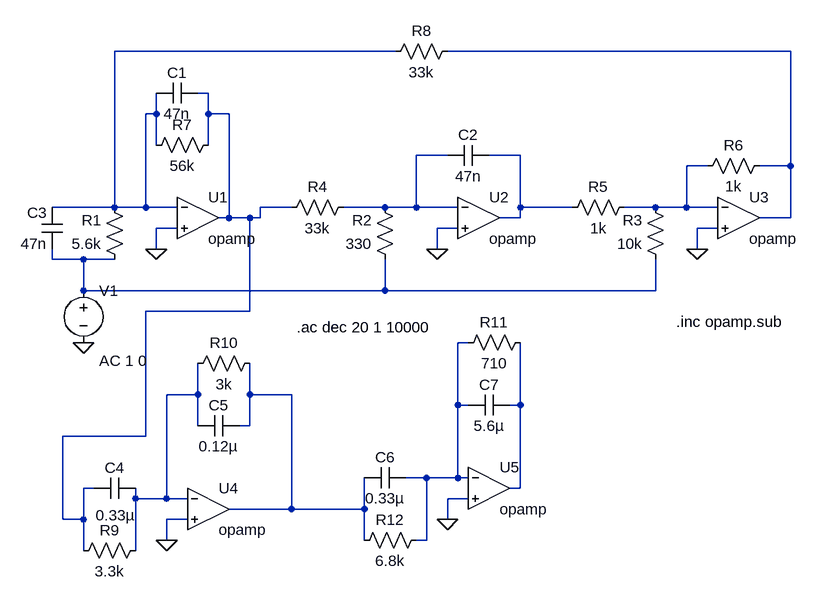
[diagram p0: schematic 344_circuit.asc]
344_circuit.asc, the LTspice schematic file:
Version 4
SHEET 1 968 1024
WIRE 352 -128 -80 -128
WIRE 960 -128 432 -128
WIRE 64 -64 48 -64
WIRE -16 -32 -16 -64
WIRE -16 -32 -32 -32
WIRE 64 -32 64 -64
WIRE 96 -32 64 -32
WIRE -16 16 -16 -32
WIRE 64 16 64 -32
WIRE 432 32 384 32
WIRE 544 32 496 32
WIRE 832 48 800 48
WIRE 960 48 960 -128
WIRE 960 48 912 48
WIRE -80 112 -80 -128
WIRE -80 112 -176 112
WIRE -32 112 -32 -32
WIRE -32 112 -80 112
WIRE 16 112 -32 112
WIRE 192 112 144 112
WIRE 336 112 272 112
WIRE 384 112 384 32
WIRE 384 112 336 112
WIRE 448 112 384 112
WIRE 544 112 544 32
WIRE 624 112 544 112
WIRE 752 112 704 112
WIRE 800 112 800 48
WIRE 800 112 752 112
WIRE 848 112 800 112
WIRE 96 128 96 -32
WIRE 96 128 80 128
WIRE 128 128 96 128
WIRE 144 128 144 112
WIRE 144 128 128 128
WIRE 544 128 544 112
WIRE 544 128 512 128
WIRE 960 128 960 48
WIRE 960 128 912 128
WIRE 16 144 -16 144
WIRE 448 144 416 144
WIRE 848 144 816 144
WIRE -16 176 -16 144
WIRE 416 176 416 144
WIRE 816 176 816 144
WIRE -176 192 -176 176
WIRE -128 192 -176 192
WIRE -80 192 -128 192
WIRE -128 240 -128 192
WIRE 336 240 336 192
WIRE 336 240 -128 240
WIRE 752 240 752 192
WIRE 752 240 336 240
WIRE 128 272 128 128
WIRE 128 272 -32 272
WIRE 464 320 448 320
WIRE 48 400 48 352
WIRE 48 400 0 400
WIRE 128 400 128 352
WIRE 192 400 128 400
WIRE 448 416 448 320
WIRE 464 416 448 416
WIRE 544 416 544 320
WIRE 544 416 528 416
WIRE 48 448 48 400
WIRE 128 448 128 400
WIRE 128 448 112 448
WIRE -32 464 -32 272
WIRE -32 464 -160 464
WIRE 400 528 368 528
WIRE 448 528 448 416
WIRE 448 528 400 528
WIRE 464 528 448 528
WIRE -112 544 -128 544
WIRE 544 544 544 416
WIRE 544 544 528 544
WIRE -48 560 -48 544
WIRE 0 560 0 400
WIRE 0 560 -48 560
WIRE 32 560 0 560
WIRE 464 560 432 560
WIRE 192 576 192 400
WIRE 192 576 96 576
WIRE 304 576 304 528
WIRE 304 576 192 576
WIRE -160 592 -160 464
WIRE -128 592 -128 544
WIRE -128 592 -160 592
WIRE 32 592 0 592
WIRE 432 592 432 560
WIRE 0 624 0 592
WIRE 304 624 304 576
WIRE 400 624 400 528
WIRE 400 624 384 624
WIRE -128 640 -128 592
WIRE -48 640 -48 560
FLAG -16 176 0
FLAG 416 176 0
FLAG 816 176 0
FLAG -128 320 0
FLAG 432 592 0
FLAG 0 624 0
SYMBOL res -64 208 R180
WINDOW 0 36 76 Left 2
WINDOW 3 36 40 Left 2
SYMATTR InstName R1
SYMATTR Value 5.6k
SYMBOL res 352 208 R180
WINDOW 0 36 76 Left 2
WINDOW 3 36 40 Left 2
SYMATTR InstName R2
SYMATTR Value 330
SYMBOL res 768 208 R180
WINDOW 0 36 76 Left 2
WINDOW 3 36 40 Left 2
SYMATTR InstName R3
SYMATTR Value 10k
SYMBOL res 176 128 R270
WINDOW 0 32 56 VTop 2
WINDOW 3 0 56 VBottom 2
SYMATTR InstName R4
SYMATTR Value 33k
SYMBOL res 608 128 R270
WINDOW 0 32 56 VTop 2
WINDOW 3 0 56 VBottom 2
SYMATTR InstName R5
SYMATTR Value 1k
SYMBOL res 816 64 R270
WINDOW 0 32 56 VTop 2
WINDOW 3 0 56 VBottom 2
SYMATTR InstName R6
SYMATTR Value 1k
SYMBOL res -32 32 R270
WINDOW 0 32 56 VTop 2
WINDOW 3 0 56 VBottom 2
SYMATTR InstName R7
SYMATTR Value 56k
SYMBOL res 336 -112 R270
WINDOW 0 32 56 VTop 2
WINDOW 3 0 56 VBottom 2
SYMATTR InstName R8
SYMATTR Value 33k
SYMBOL cap 48 -80 R90
WINDOW 0 0 32 VBottom 2
WINDOW 3 32 32 VTop 2
SYMATTR InstName C1
SYMATTR Value 47n
SYMBOL cap 496 16 R90
WINDOW 0 0 32 VBottom 2
WINDOW 3 32 32 VTop 2
SYMATTR InstName C2
SYMATTR Value 47n
SYMBOL cap -160 176 R180
WINDOW 0 24 56 Left 2
WINDOW 3 24 8 Left 2
SYMATTR InstName C3
SYMATTR Value 47n
SYMBOL OpAmps\\opamp 48 64 R0
SYMATTR InstName U1
SYMBOL OpAmps\\opamp 480 64 R0
SYMATTR InstName U2
SYMBOL OpAmps\\opamp 880 64 R0
SYMATTR InstName U3
SYMBOL voltage -128 224 R0
WINDOW 123 24 124 Left 2
WINDOW 39 0 0 Left 0
SYMATTR Value2 AC 1 0
SYMATTR InstName V1
SYMATTR Value ""
SYMBOL cap -48 528 R90
WINDOW 0 0 32 VBottom 2
WINDOW 3 42 31 VTop 2
SYMATTR InstName C4
SYMATTR Value 0.33µ
SYMBOL cap 112 432 R90
WINDOW 0 0 32 VBottom 2
WINDOW 3 32 32 VTop 2
SYMATTR InstName C5
SYMATTR Value 0.12µ
SYMBOL cap 368 512 R90
WINDOW 0 0 32 VBottom 2
WINDOW 3 32 32 VTop 2
SYMATTR InstName C6
SYMATTR Value 0.33µ
SYMBOL cap 528 400 R90
WINDOW 0 0 32 VBottom 2
WINDOW 3 32 32 VTop 2
SYMATTR InstName C7
SYMATTR Value 5.6µ
SYMBOL res -32 624 R90
WINDOW 0 0 56 VBottom 2
WINDOW 3 32 56 VTop 2
SYMATTR InstName R9
SYMATTR Value 3.3k
SYMBOL res 144 336 R90
WINDOW 0 0 56 VBottom 2
WINDOW 3 32 56 VTop 2
SYMATTR InstName R10
SYMATTR Value 3k
SYMBOL res 560 304 R90
WINDOW 0 0 56 VBottom 2
WINDOW 3 32 56 VTop 2
SYMATTR InstName R11
SYMATTR Value 710
SYMBOL res 400 608 R90
WINDOW 0 0 56 VBottom 2
WINDOW 3 32 56 VTop 2
SYMATTR InstName R12
SYMATTR Value 6.8k
SYMBOL OpAmps\\opamp 64 512 R0
SYMATTR InstName U4
SYMBOL OpAmps\\opamp 496 480 R0
SYMATTR InstName U5
TEXT 200 296 Left 2 !.ac dec 20 1 10000
TEXT 784 288 Left 2 !.inc opamp.sub

The netlist it stands for:
* 344_circuit.asc
R1 N007 N001 5.6k
R2 N007 N004 330
R3 N007 N006 10k
R4 N003 N004 33k
R5 N005 N006 1k
R6 N006 N002 1k
R7 N001 N003 56k
R8 N001 N002 33k
C1 N003 N001 47n
C2 N005 N004 47n
C3 N007 N001 47n
XU1 N001 0 N003 opamp Aol=100K GBW=10Meg  ; pins invin noninvin out
XU2 N004 0 N005 opamp Aol=100K GBW=10Meg  ; pins invin noninvin out
XU3 N006 0 N002 opamp Aol=100K GBW=10Meg  ; pins invin noninvin out
V1 N007 0 AC 1 0
C4 N009 N003 0.33µ
C5 N010 N009 0.12µ
C6 N008 N010 0.33µ
C7 N011 N008 5.6µ
R9 N009 N003 3.3k
R10 N010 N009 3k
R11 N011 N008 710
R12 N008 N010 6.8k
XU4 N009 0 N010 opamp Aol=100K GBW=10Meg  ; pins invin noninvin out
XU5 N008 0 N011 opamp Aol=100K GBW=10Meg  ; pins invin noninvin out
.ac dec 20 1 10000
.inc opamp.sub
.backanno
.end